# EAGLE design PROJETO COMPLETO (EAGLE 9.6.2)
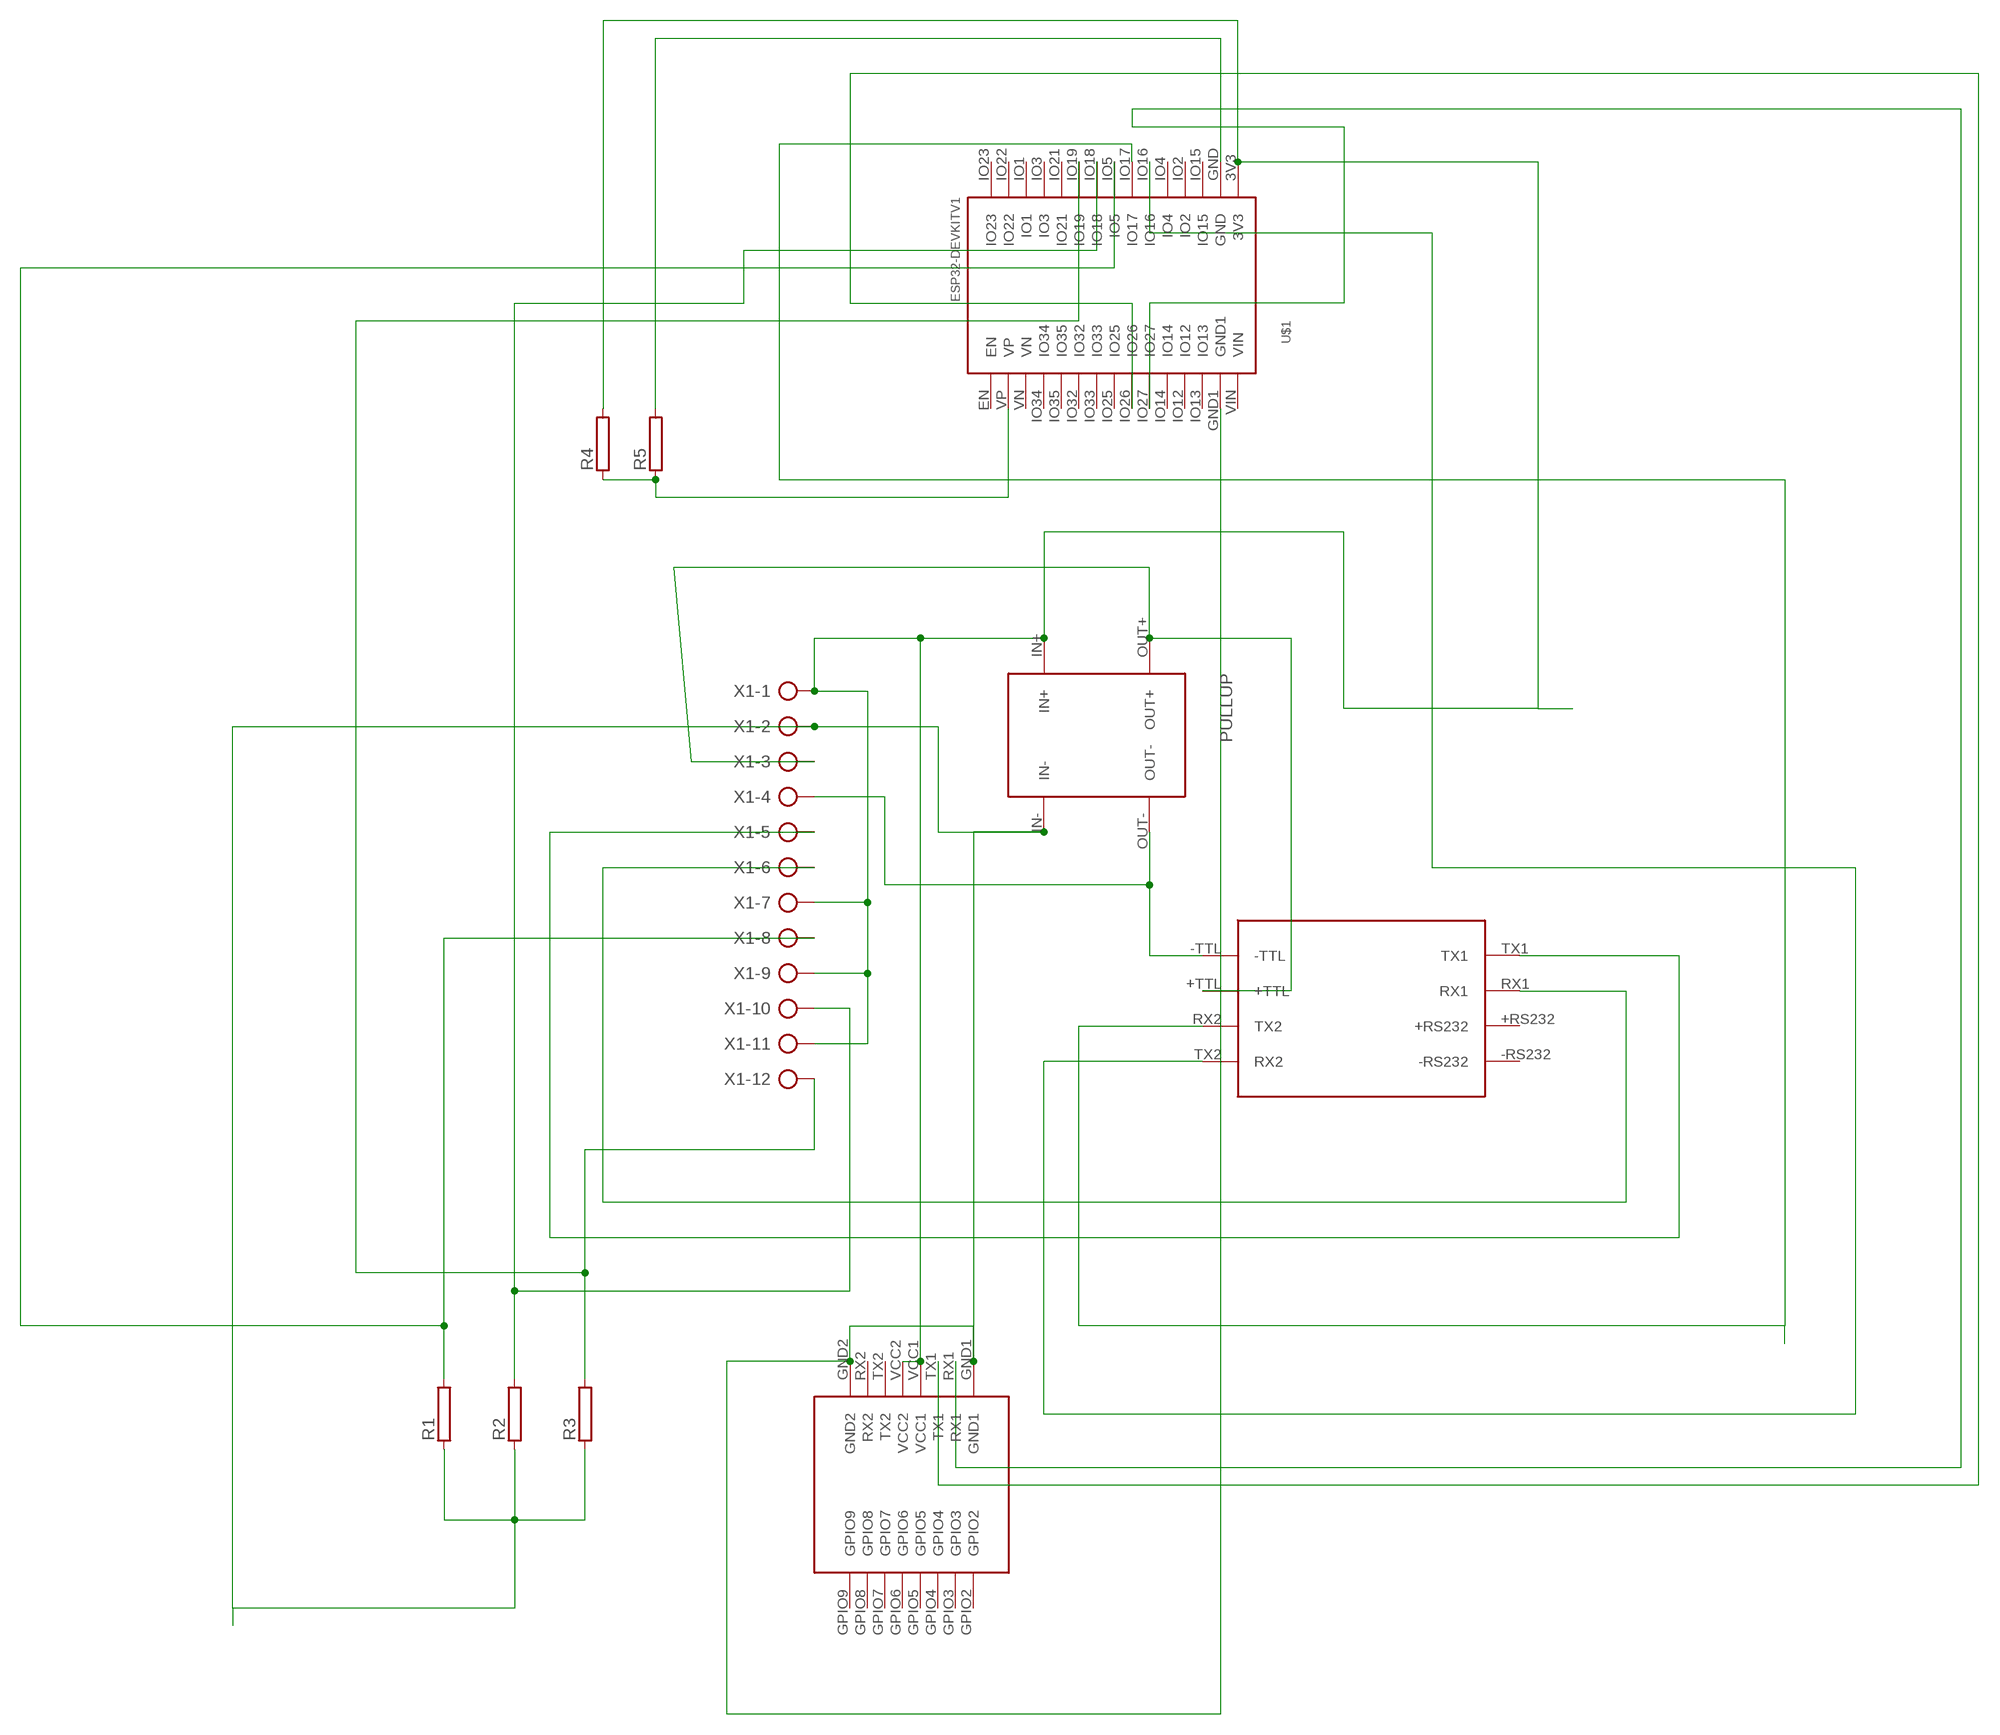
[diagram p0: schematic, sheet 1]

## Parts
R1  RAC01  [AC01]
R2  RAC01  [AC01]
R3  RAC01  [AC01]
R4  RAC01  [AC01]
R5  RAC01  [AC01]
U$1  ESP32DEVKITV1  [ESP32-DEVKITV1]
U$2  RADIOENGE  [RADIOENGE]
U$3  MAX3232  [MAX3232]
U$4  PULLUP  [PULLUP]
X1  AK500/12-H  [AK500/12-H]

## Nets
N$1: U$1.IO17 U$3.RX2(TX2)
N$2: U$1.IO16 U$3.TX2(RX2)
N$3: U$3.+TTL U$4.OUT+ X1.3
N$4: U$3.-TTL U$4.OUT- X1.4
N$5: U$3.TX1 X1.5
N$6: U$3.RX1 X1.6
N$7: R5.2 U$1.GND
N$8: R4.1 R5.1 U$1.VP
N$9: U$1.IO27 U$2.RX1
N$10: U$1.IO26 U$2.TX1
N$11: R3.2 U$1.IO19 X1.12
N$12: R2.2 U$1.IO18 X1.10
N$13: R1.2 U$1.IO5 X1.8
N$14: R1.1 R2.1 R3.1 U$1.GND1 U$2.GND1 U$2.GND2 U$4.IN- X1.2
N$15: R4.2 U$1.3V3 U$2.VCC1 U$2.VCC2 U$4.IN+ X1.1 X1.7 X1.9 X1.11
Unconnected: U$1.EN U$1.IO1 U$1.IO2 U$1.IO3 U$1.IO4 U$1.IO12 U$1.IO13 U$1.IO14 U$1.IO15 U$1.IO21 U$1.IO22 U$1.IO23 U$1.IO25 U$1.IO32 U$1.IO33 U$1.IO34 U$1.IO35 U$1.VIN U$1.VN U$2.GPIO2 U$2.GPIO3 U$2.GPIO4 U$2.GPIO5 U$2.GPIO6 U$2.GPIO7 U$2.GPIO8 U$2.GPIO9 U$2.RX2 U$2.TX2 U$3.+RS232 U$3.-RS232

## Library data of the parts
R1-R5 = resistor-power:R: Power Resitor; OC_FARNELL: unknown; OC_NEWARK: unknown
U$1 = ESP32-DEVKITV1:ESP32DEVKITV1
U$2 = lib_radio:RADIOENGE
U$3 = MAX3232:MAX3232
U$4 = PULL UP:PULLUP
X1 = con-ptr500:AK500/12-H: CONNECTOR Aug. 2004 / PTR Meßtechnik: Die Bezeichnung der Serie AK505 wurde geändert. Es handelt sich hierbei um AK500 in horizontaler Ausführung.; OC_FARNELL: unknown; OC_NEWARK: unknown

## Board
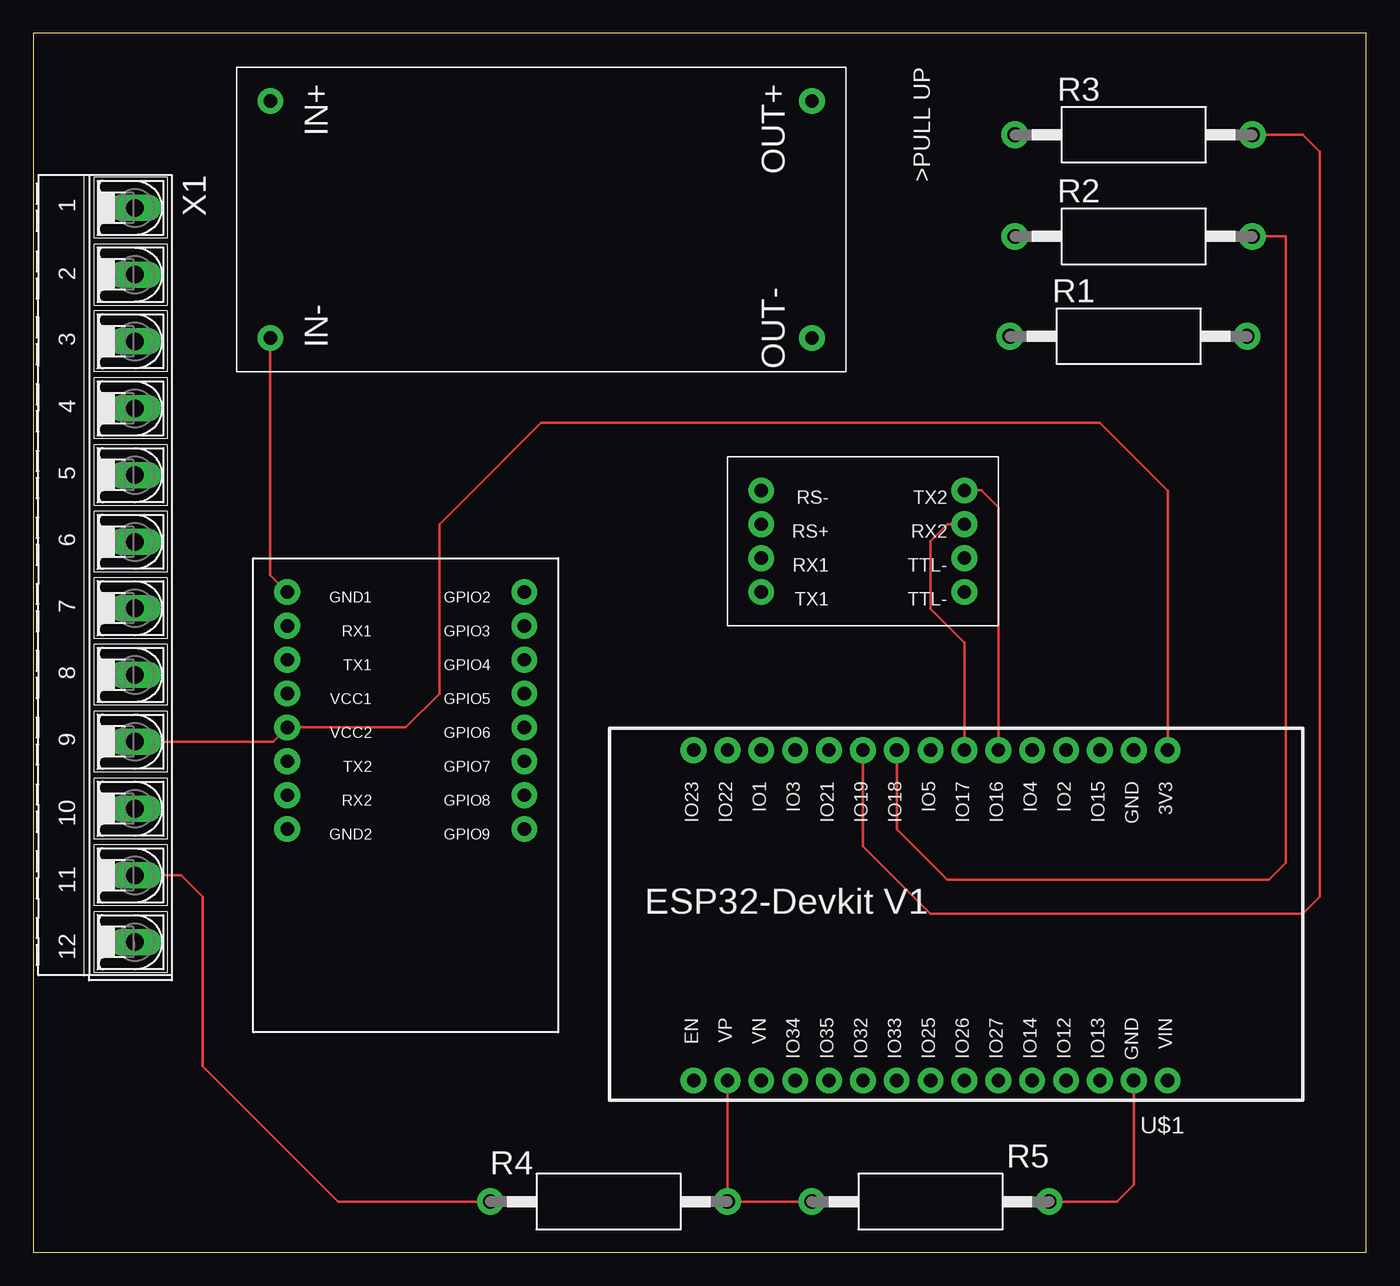
[diagram p1: board, top side]
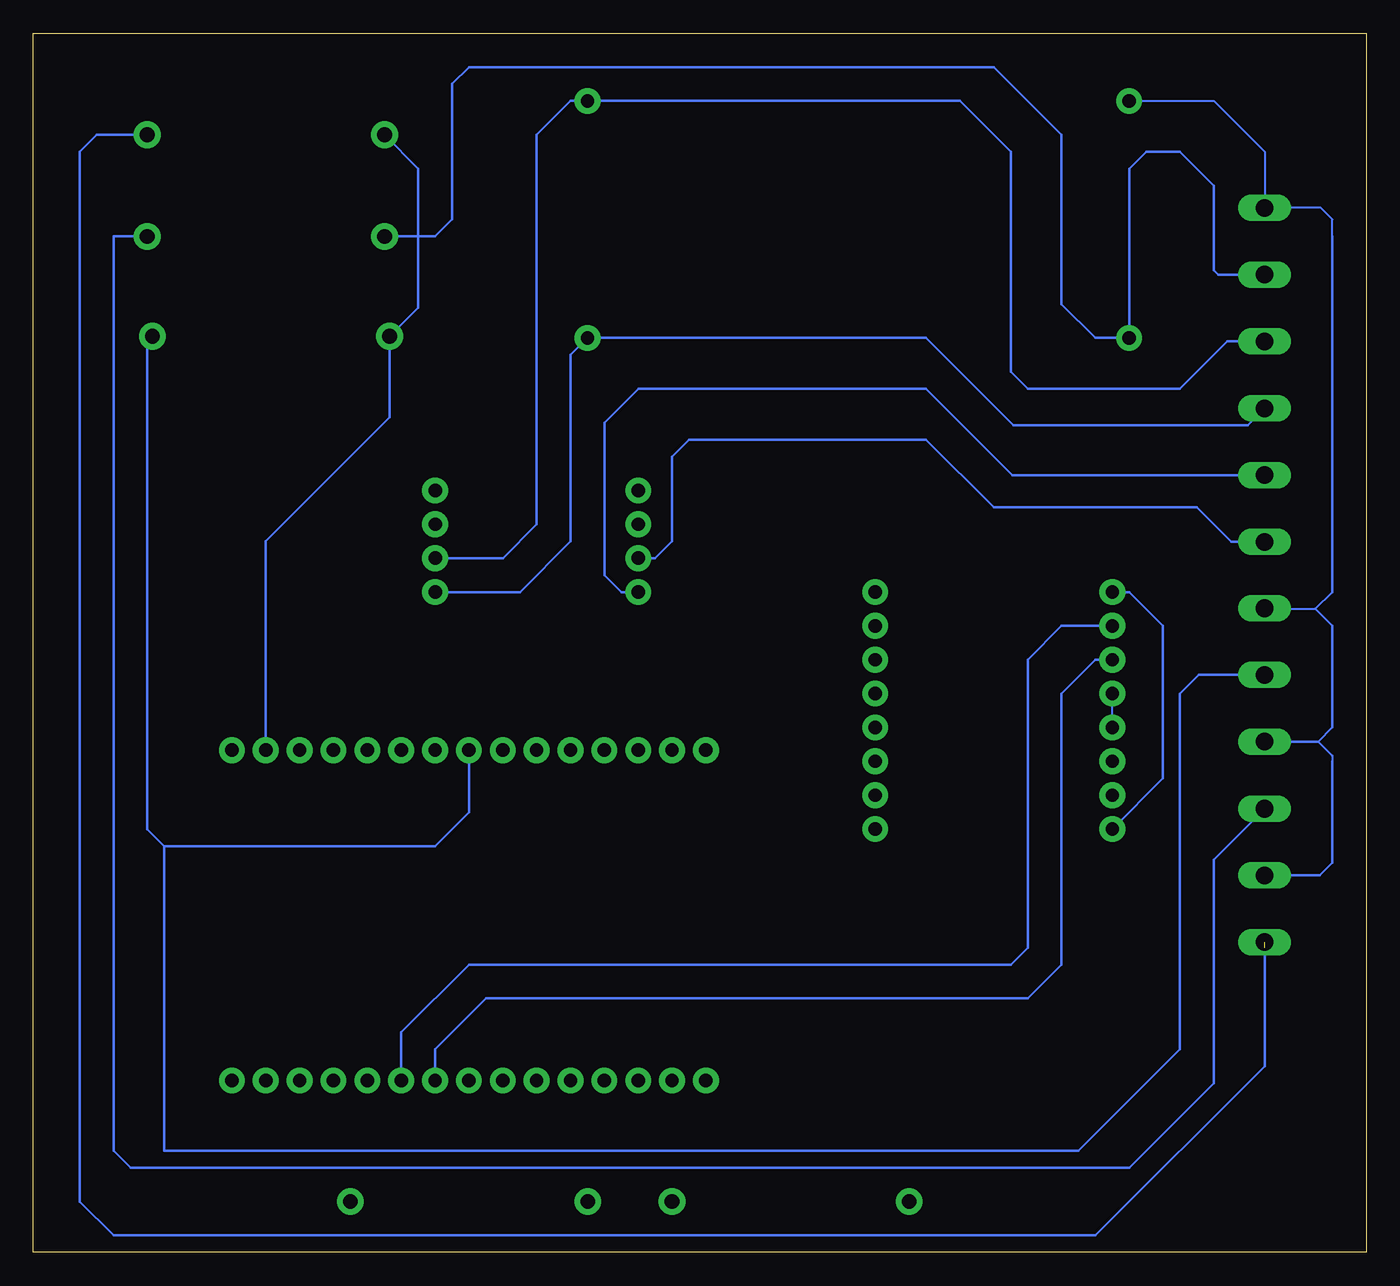
[diagram p2: board, bottom side, seen from below]

Size 100 x 91.43 mm. Coordinates in mm from the lower left corner, seen from the top.
Outline: 0,0 100,0 100,91.43 0,91.43 0,0
Copper layers (1*16): Top 0.035mm / dielectric 1.5mm / Bottom 0.035mm
Design rules "default": minimum track width 6mil, minimum drill 0.35mm, track to track 6mil, track to pad 6mil, pad to pad 6mil, via to via 6mil, smd to smd 6mil, copper to edge 40mil, drill to drill 6mil, minimum pad ring 10mil, minimum via ring 8mil, stop-mask expansion 4mil, vias tented up to drill 0mil, thermal gap 10mil

### Footprints (pad centres in the part's own frame; a part is rotated, then mirrored left to right if it is on the bottom)
AC01 = drill 1.1 pad 2: 1 -8.9,0; 2 8.9,0
ESP32-DEVKITV1 = drill 1 pad 1.93: 3V3 -22.87,-13.54; EN 12.69,11.23; GND -20.33,11.23; GND1 -20.33,-13.54; IO1 7.61,-13.54; IO2 -15.25,-13.54; IO3 5.07,-13.54; IO4 -12.71,-13.54; IO5 -5.09,-13.54; IO12 -15.25,11.23; IO13 -17.79,11.23; IO14 -12.71,11.23; IO15 -17.79,-13.54; IO16 -10.17,-13.54; IO17 -7.63,-13.54; IO18 -2.55,-13.54; IO19 -0.01,-13.54; IO21 2.53,-13.54; IO22 10.15,-13.54; IO23 12.69,-13.54; IO25 -5.09,11.23; IO26 -7.63,11.23; IO27 -10.17,11.23; IO32 -0.01,11.23; IO33 -2.55,11.23; IO34 5.07,11.23; IO35 2.53,11.23; VIN -22.87,11.23; VN 7.61,11.23; VP 10.15,11.23
RADIOENGE = drill 1 pad 1.93: GND1 1.27,-10.16; GND2 1.27,7.62; GPIO2 -16.51,-10.16; GPIO3 -16.51,-7.62; GPIO4 -16.51,-5.08; GPIO5 -16.51,-2.54; GPIO6 -16.51,0; GPIO7 -16.51,2.54; GPIO8 -16.51,5.08; GPIO9 -16.51,7.62; RX1 1.27,-7.62; RX2 1.27,5.08; TX1 1.27,-5.08; TX2 1.27,2.54; VCC1 1.27,-2.54; VCC2 1.27,0
MAX3232 = drill 1 pad 1.93: +RS232 3.81,1.27; +TTL -11.43,3.81; -RS232 3.81,-1.27; -TTL -11.43,6.35; RX1 3.81,3.81; RX2 -11.43,1.27; TX1 3.81,6.35; TX2 -11.43,-1.27
PULLUP = drill 1 pad 1.93: IN+ -8.89,-31.75; IN- 8.89,-31.75; OUT+ -8.89,8.89; OUT- 8.89,8.89
AK500/12-H = drill 1.321 long: 1 -27.534,0; 2 -22.53,0; 3 -17.526,0; 4 -12.497,0; 5 -7.493,0; 6 -2.489,0; 7 2.489,0; 8 7.493,0; 9 12.497,0; 10 17.526,0; 11 22.53,0; 12 27.534,0

### Placement (x,y rotation side)
R1  82.17,68.71 0 top
R2  82.55,76.2 0 top
R3  82.55,83.82 0 top
R4  43.18,3.81 180 top
R5  67.31,3.81 0 top
U$1  62.23,24.13 180 top
U$2  20.32,39.37 180 top
U$3  58.42,55.88 180 top
U$4  49.53,77.47 270 top
X1  7.62,50.8 270 top

### Tracks (layer width: path | path; a pad name or v marks a point on that pad's centre or on a via)
N$1
  Top 0.203: U$1.IO17 69.86,45.71 67.31,48.26 67.31,53.34 68.58,54.61 U$3.RX2
N$2
  Top 0.203: U$3.TX2 71.12,57.15 72.4,55.87 U$1.IO16
N$3
  Bottom 0.203: X1.3 10.41,68.33 13.97,64.77 25.4,64.77 26.67,66.04 26.67,82.55 30.48,86.36 U$4.OUT+ 59.69,86.36 62.23,83.82 62.23,54.61 64.77,52.07 U$3.+TTL
N$4
  Bottom 0.203: X1.4 8.89,62.03 26.47,62.03 33.02,68.58 U$4.OUT- 59.69,67.31 59.69,53.34 63.5,49.53 U$3.-TTL
N$5
  Bottom 0.203: U$3.TX1 55.88,49.53 57.15,50.8 57.15,62.23 54.61,64.77 33.02,64.77 26.54,58.29 X1.5
N$6
  Bottom 0.203: 7.67,53.34 7.64,53.32 | 7.64,53.32 X1.6 | U$3.RX1 53.34,52.07 52.07,53.34 52.07,59.69 50.8,60.96 33.02,60.96 27.94,55.88 12.7,55.88 10.13,53.32 7.64,53.32
N$7
  Top 0.203: R5.2 81.28,3.81 82.56,5.09 U$1.GND
N$8
  Top 0.203: R5.1 R4.1 U$1.VP
N$9
  Bottom 0.203: U$1.IO27 72.4,16.5 67.31,21.59 26.67,21.59 25.4,22.86 25.4,44.45 22.86,46.99 U$2.RX1
N$10
  Bottom 0.203: U$1.IO26 69.86,15.23 66.04,19.05 25.4,19.05 22.86,21.59 22.86,41.91 20.32,44.45 U$2.TX1
N$11  (1 unrouted)
  Top 0.203: U$1.IO19 62.24,30.47 67.31,25.4 95.25,25.4 96.52,26.67 96.52,82.55 95.25,83.82 R3.2
  Bottom 0.203: R3.2 95.25,83.82 96.52,82.55 96.52,3.81 93.98,1.27 20.32,1.27 7.62,13.97 7.62,22.86
N$12
  Top 0.203: U$1.IO18 64.78,31.74 68.58,27.94 92.71,27.94 93.98,29.21 93.98,76.2 R2.2
  Bottom 0.152: 92.71,6.35 93.98,7.62
  Bottom 0.203: R2.2 93.98,76.2 93.98,7.62 | 92.71,6.35 17.78,6.35 11.43,12.7 11.43,29.46 X1.10
N$13
  Bottom 0.152: 90.17,30.48 91.44,31.75
  Bottom 0.203: R1.2 91.44,68.71 91.44,31.75 | X1.8 12.57,43.31 13.97,41.91 13.97,15.24 21.59,7.62 90.17,7.62 90.17,30.48 69.85,30.48 67.31,33.02 67.32,33.03 U$1.IO5
N$14
  Top 0.203: U$4.IN- 17.78,50.8 U$2.GND1
  Bottom 0.203: R3.1 71.12,81.29 71.12,76.2 | 71.12,76.2 71.12,70.86 R1.1 73.27,62.62 82.56,53.33 U$1.GND1 | 71.12,76.2 R2.1 69.85,76.2 68.58,77.47 68.58,87.63 67.31,88.9 27.94,88.9 22.86,83.82 22.86,71.12 20.32,68.58 U$4.IN- 17.78,81.28 16.51,82.55 13.97,82.55 11.43,80.01 11.43,73.66 11.1,73.33 X1.2 8.89,73.33 | U$2.GND1 17.78,49.53 15.24,46.99 15.24,35.56 U$2.GND2
N$15
  Top 0.203: X1.9 17.98,38.3 U$2.VCC2 27.94,39.37 30.48,41.91 30.48,54.61 38.1,62.23 80.01,62.23 85.1,57.14 U$1.3V3 | R4.2 22.86,3.81 12.7,13.97 12.7,26.67 11.1,28.27 X1.11
  Bottom 0.152: U$2.VCC2 U$2.VCC1 | 2.54,76.2 2.54,77.47 3.4,78.33 X1.1 7.62,82.55 11.43,86.36 U$4.IN+ | X1.7 7.57,48.26 3.81,48.26 | 2.54,37.24 2.54,36.83
  Bottom 0.203: 2.54,76.2 2.54,49.53 3.81,48.26 2.54,46.99 2.54,39.37 3.61,38.3 | 3.61,38.3 X1.9 | 2.54,36.83 2.54,29.21 3.48,28.27 X1.11 | 2.54,37.24 3.61,38.3